# Altium schematic sheet 0005_BLOCK DIAGRAM - MA.SchDoc
size 848 x 558 mm
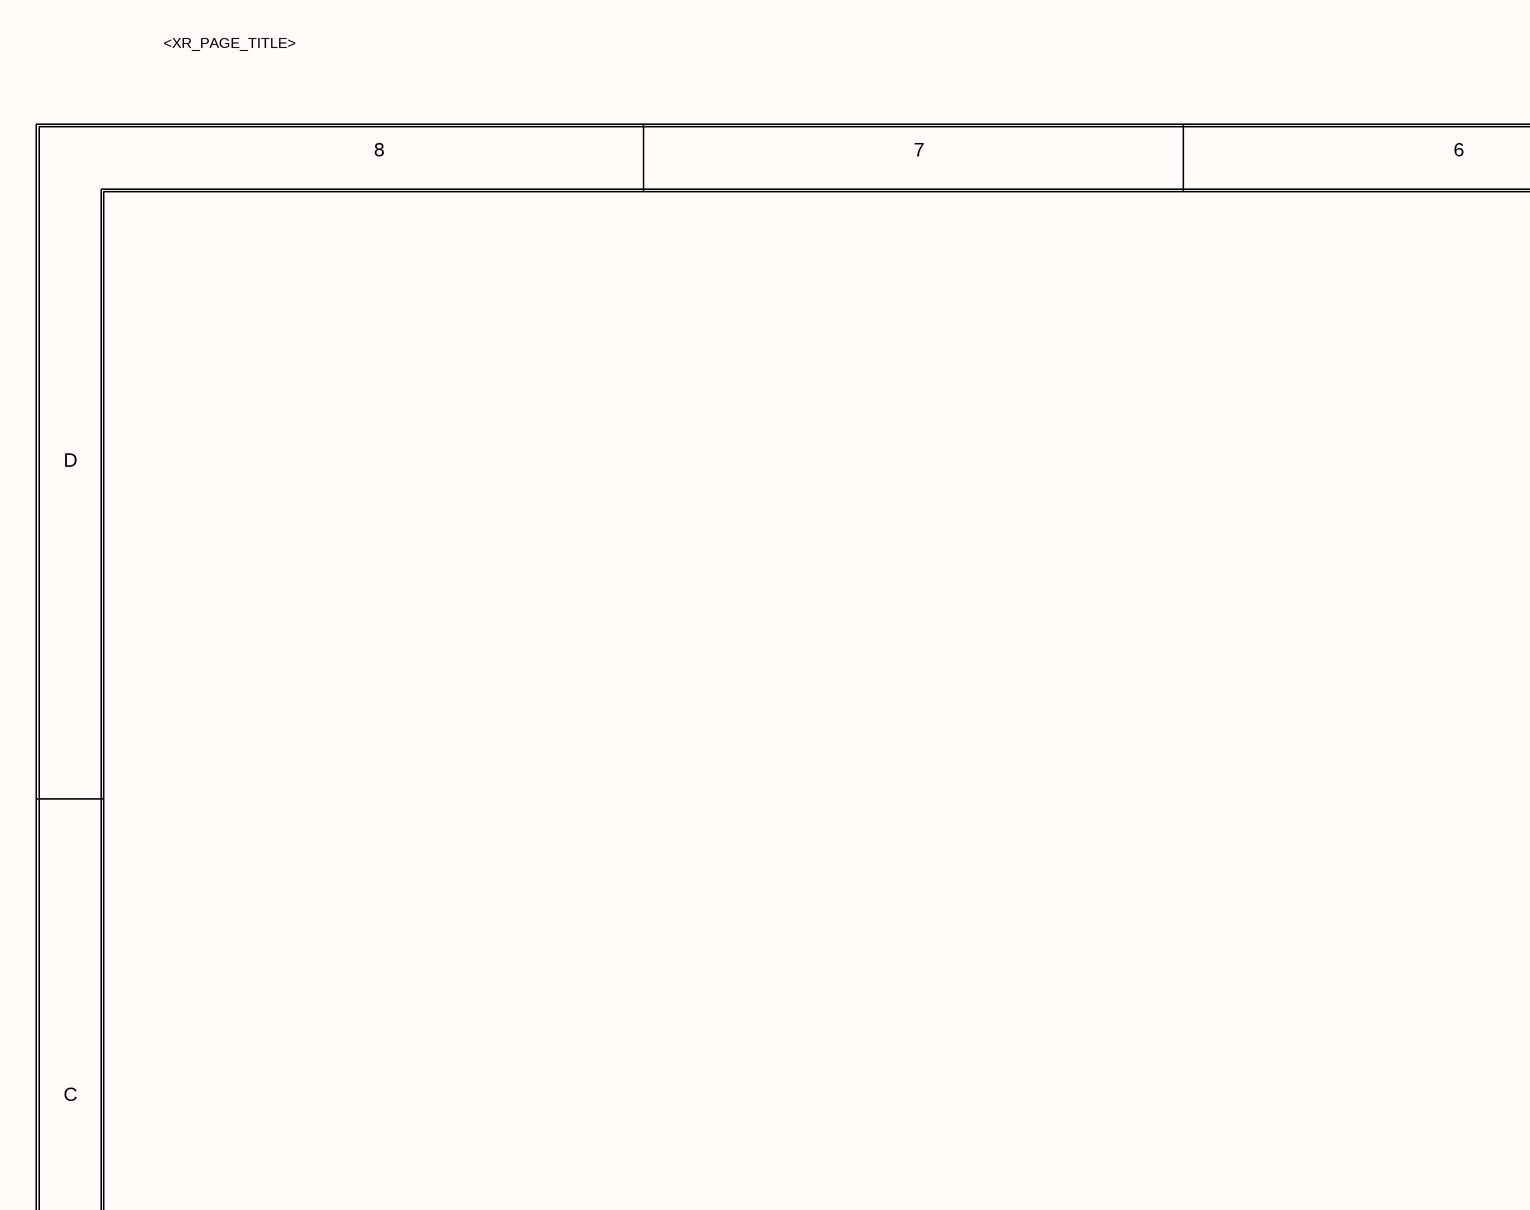
[diagram p0: 0005_BLOCK DIAGRAM - MA.SchDoc, top left]
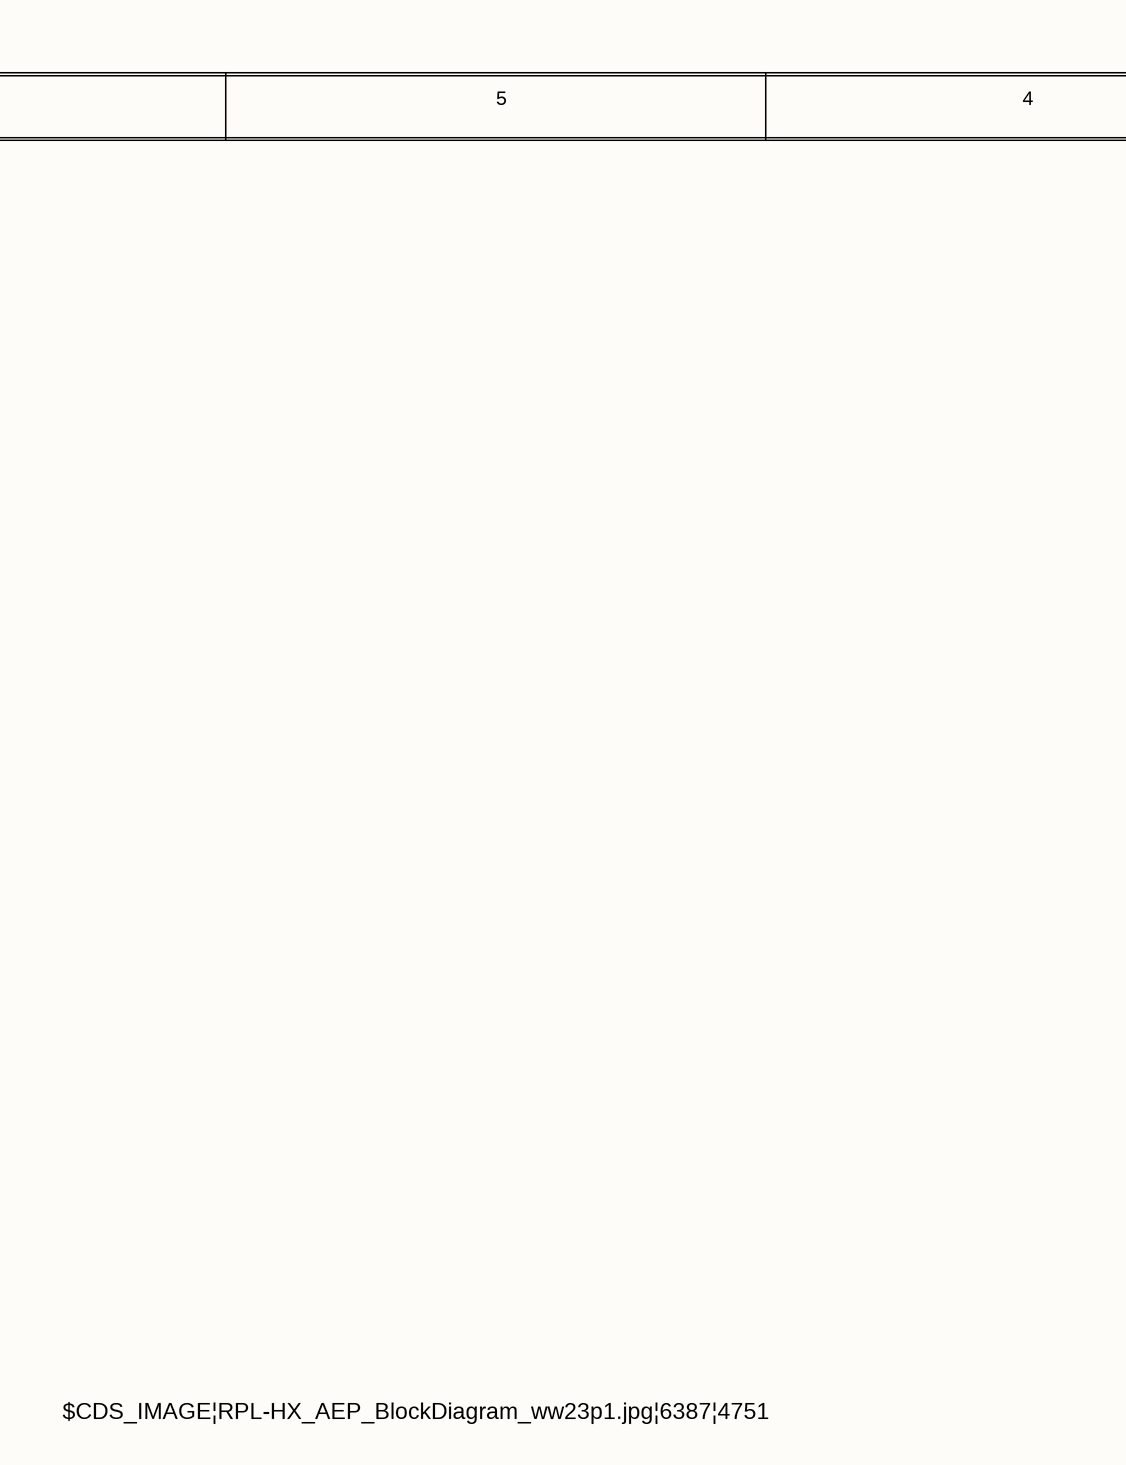
[diagram p1: 0005_BLOCK DIAGRAM - MA.SchDoc, top middle]
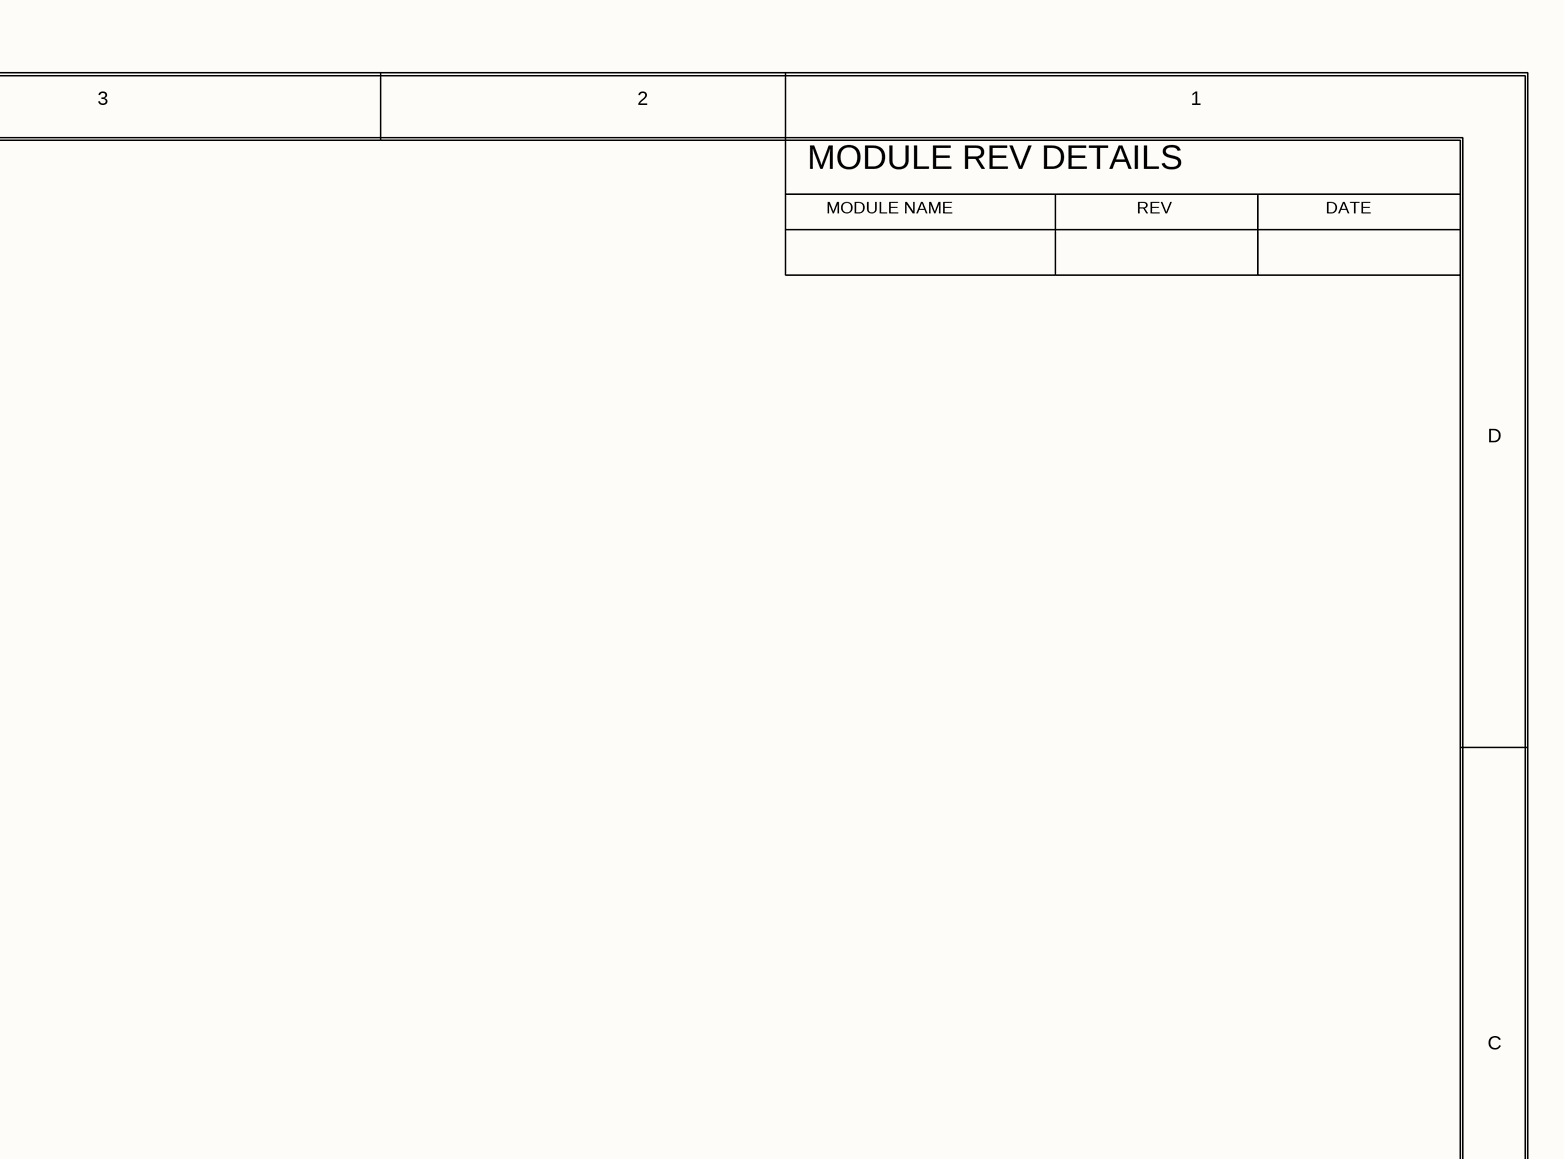
[diagram p2: 0005_BLOCK DIAGRAM - MA.SchDoc, top right]
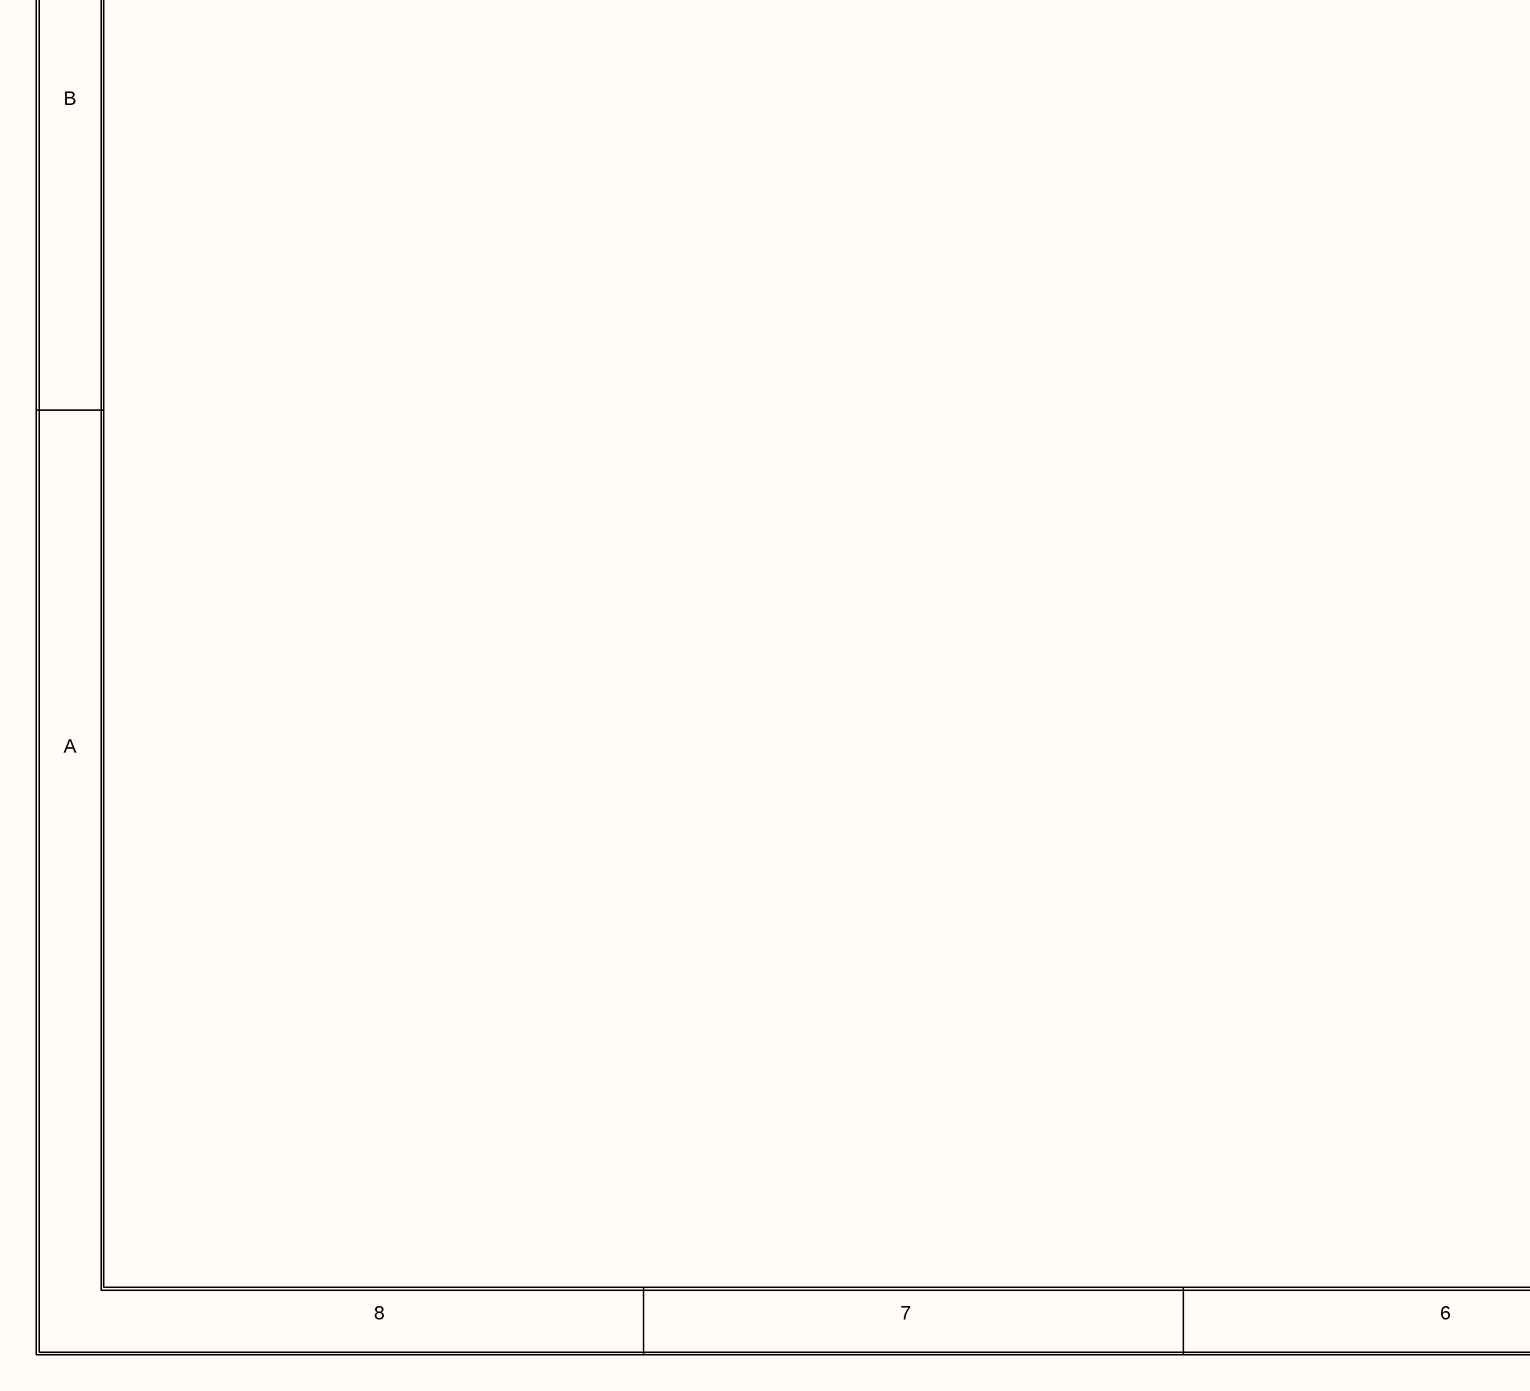
[diagram p3: 0005_BLOCK DIAGRAM - MA.SchDoc, bottom left]
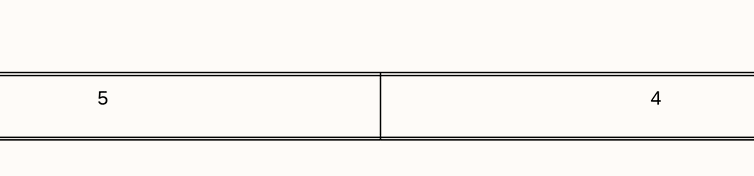
[diagram p4: 0005_BLOCK DIAGRAM - MA.SchDoc, bottom middle]
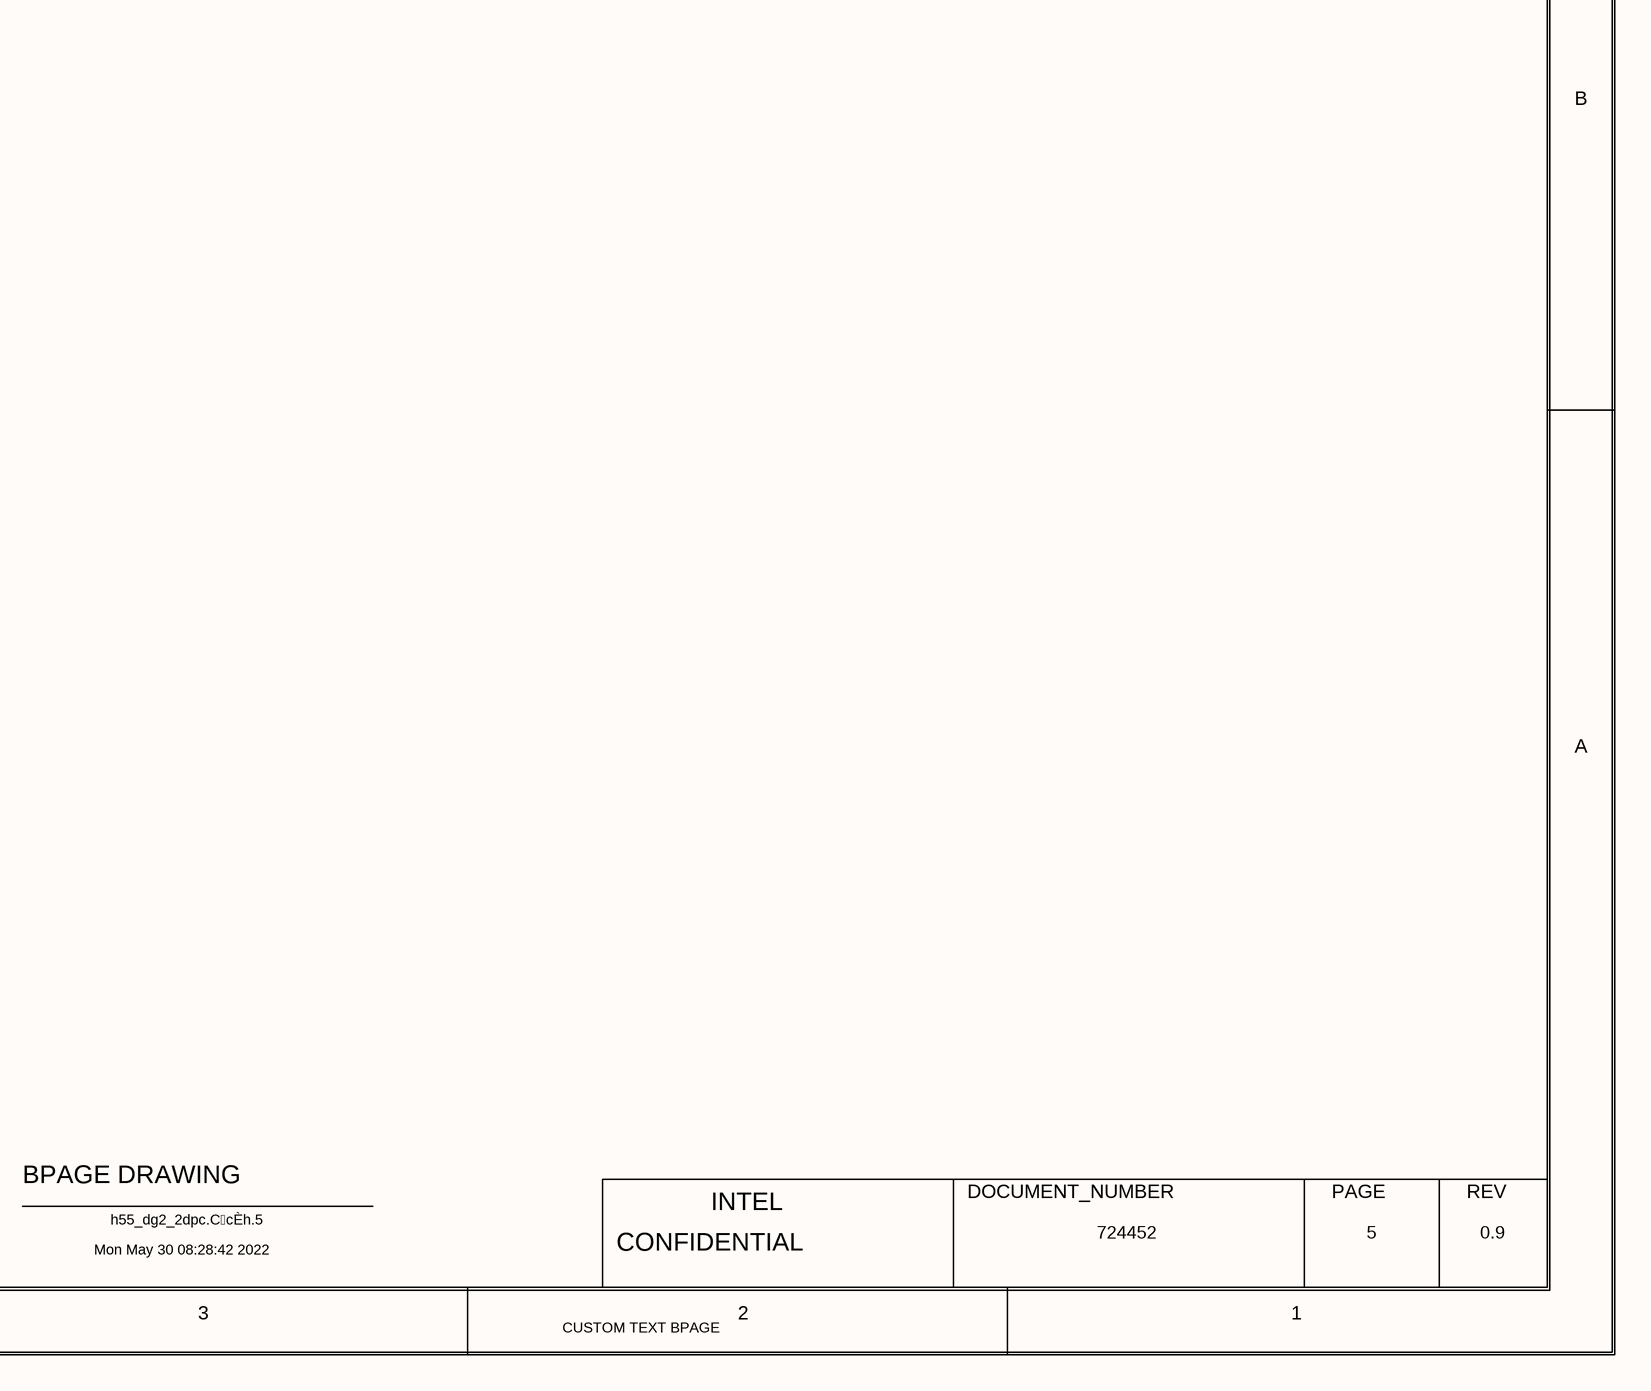
[diagram p5: 0005_BLOCK DIAGRAM - MA.SchDoc, bottom right]

## Notes on the sheet
- <XR_PAGE_TITLE>
- 8
- 7
- 6
- 5
- 4
- 3
- 2
- 1
- MODULE REV DETAILS
- MODULE NAME
- REV
- DATE
- D
- C
- $CDS_IMAGE|RPL-HX_AEP_BlockDiagram_ww23p1.jpg|6387|4751
- B
- A
- BPAGE DRAWING
- INTEL
- DOCUMENT_NUMBER
- PAGE
- Mon May 30 08:28:42 2022
- h55_dg2_2dpc.CcÈh.5
- CONFIDENTIAL
- 724452
- 0.9
- CUSTOM TEXT BPAGE